# Altium schematic sheet Oscillator.SchDoc
size A4; SheetNumber: 2; SheetTotal: 2
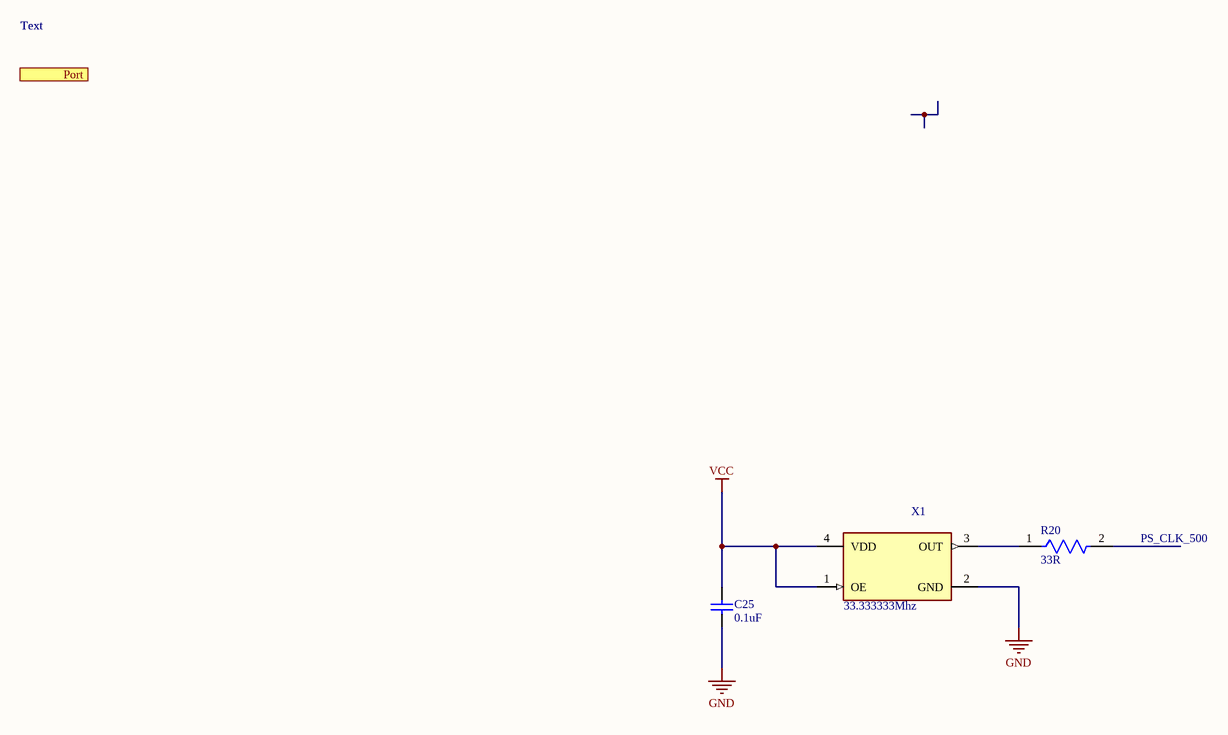
[diagram p0: Oscillator.SchDoc]

## Parts
C25  0.1uF  [CAPC1608X90X35ML10T15]
R20  33R  [FP-CRCW0603-e3-IPC_A]
  33.333333Mhz  [FP-SiT8208-3-MFG]

## Ports
Port

## Nets
GND: C25.1 .2(GND)
VCC: C25.2 .1(OE) .4(VDD)
NetR20_1: R20.1 .3(OUT)

Not connected (* = marked no-connect by the designer): R20 2

## Notes on the sheet
- Text
- X1
- PS_CLK_500

## Library data of the parts
C25 = CMP-2100-03643-1: Chip Capacitor, 0.1 uF, +/- 10%, 50 V, -55 to 125 degC, 0603 (1608 Metric), RoHS, Tape and Reel; Manufacturer: Murata; Dielectric Material: Ceramic; Voltage Rating: 50V; Capacitance: 100nF; Dielectric: X7R; Insulation Resistance: 10GR; Case Code (Metric): 1608; Lead Free: LeadFree; Depth: 0.8mm; Number of Pins: 2; Radiation Hardening: No; Case/Package: 0603; Manufacturer URL: http://www.murata.com/; Packaging: TapeandReel; Length: 1.6mm; Contact Plating: Tin; Datasheet URL: http://psearch.en.murata.com/capacitor/product/GRM188R71H104KA93%23.pdf; Tolerance: 10%; Case Code (Imperial): 0603; Min Operating Temperature: -55degC; RoHSCompliant: true; Voltage: 50V; Termination: SMD/SMT; Mount: SurfaceMount; Material: Ceramic; Package Quantity: 1; Height: 0.8mm; Thickness: 0.035inch; REACH SVHC: NoSVHC; Max Operating Temperature: 125degC; Width: 0.8mm; Package Reference: 0603; Voltage Rating (DC): 50V; Datasheet Version: 42675.0; Package Description: 2-Pin Surface Mount Device, Body 1.6 x 0.8 mm
R20 = CMP-2000-03250-2: RES Thick Film, 33Ω, 1%, 0.1W, 100ppm/°C, 0603; Voltage Rating: 75V; Max Power Dissipation: 100mW; Case/Package: 0603; Weight: 7.1E-05oz; Termination: SMD/SMT; Voltage Rating (DC): 75V; Packaging: Tape and Reel; Width: 0.85mm; Depth: 0.85mm; Mount: Surface Mount; Number of Terminations: 2; Min Operating Temperature: -55°C; Military Standard: Not; Package Quantity: 10; Contact Plating: Tin; Resistance: 33R; Radiation Hardening: No; Lead Free: Lead Free; Tolerance: 1%; Power Rating: 100mW; Features: Automotive AEC-Q200; Height: 0.45mm; Case Code (Metric): 1608; Length: 1.55mm; Composition: Thick Film; Max Operating Temperature: 155°C; Temperature Coefficient: 100ppm/°C; Case Code (Imperial): 0603
 = CMP-25159-260629-1: MEMS OSC XO 36.0000MHZ LVCMOS LV; Max Supply Current: 33mA; Frequency: 36MHz; Frequency Stability: 50ppm; Packaging: Tape and Reel; Case/Package: SMD/SMT; Max Operating Temperature: 70°C; RoHS Compliant: Yes; Min Operating Temperature: -20°C; Series: SIT8208; Mount: Surface Mount